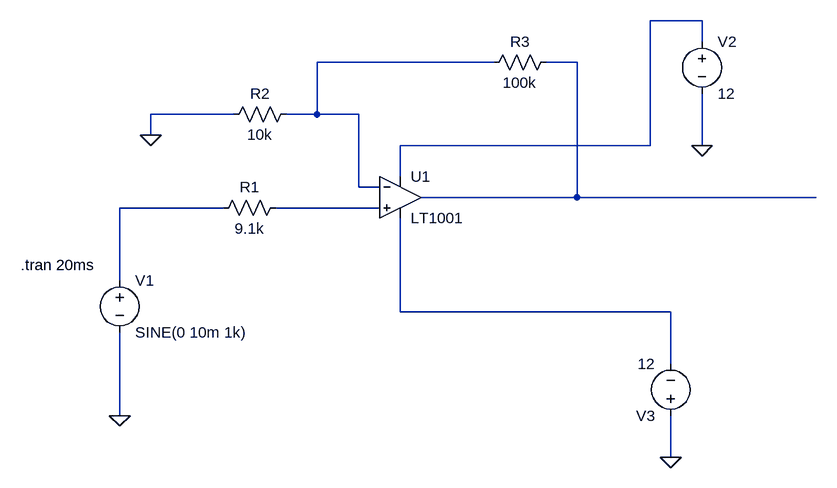
[diagram p0: schematic non-inverting amplifier.asc]
non-inverting amplifier.asc, the LTspice schematic file:
Version 4
SHEET 1 880 680
WIRE 688 -112 608 -112
WIRE 688 -80 688 -112
WIRE 368 -48 96 -48
WIRE 496 -48 448 -48
WIRE -32 32 -160 32
WIRE 96 32 96 -48
WIRE 96 32 48 32
WIRE 160 32 96 32
WIRE -160 64 -160 32
WIRE 608 80 608 -112
WIRE 608 80 224 80
WIRE 688 80 688 0
WIRE 224 128 224 80
WIRE 160 144 160 32
WIRE 192 144 160 144
WIRE 496 160 496 -48
WIRE 496 160 256 160
WIRE 864 160 496 160
WIRE -48 176 -208 176
WIRE 192 176 32 176
WIRE -208 288 -208 176
WIRE 224 336 224 192
WIRE 640 336 224 336
WIRE 640 416 640 336
WIRE -208 496 -208 368
WIRE 640 560 640 496
FLAG -208 496 0
FLAG -160 64 0
FLAG 688 80 0
FLAG 640 560 0
SYMBOL Opamps\\LT1001 224 96 R0
SYMATTR InstName U1
SYMBOL voltage -208 272 R0
WINDOW 123 0 0 Left 0
WINDOW 39 0 0 Left 0
SYMATTR InstName V1
SYMATTR Value SINE(0 10m 1k)
SYMBOL voltage 688 -96 R0
WINDOW 123 0 0 Left 0
WINDOW 39 0 0 Left 0
SYMATTR InstName V2
SYMATTR Value 12
SYMBOL voltage 640 512 R180
WINDOW 123 0 0 Left 0
WINDOW 39 0 0 Left 0
SYMATTR InstName V3
SYMATTR Value 12
SYMBOL res 48 160 R90
WINDOW 0 0 56 VBottom 2
WINDOW 3 32 56 VTop 2
SYMATTR InstName R1
SYMATTR Value 9.1k
SYMBOL res 64 16 R90
WINDOW 0 0 56 VBottom 2
WINDOW 3 32 56 VTop 2
SYMATTR InstName R2
SYMATTR Value 10k
SYMBOL res 464 -64 R90
WINDOW 0 0 56 VBottom 2
WINDOW 3 32 56 VTop 2
SYMATTR InstName R3
SYMATTR Value 100k
TEXT -360 264 Left 2 !.tran 20ms

The netlist it stands for:
* non-inverting amplifier.asc
XU1 N005 N002 N001 N006 N003 LT1001  ; pins In+ In- V+ V- OUT
V1 N004 0 SINE(0 10m 1k)
V2 N001 0 12
V3 0 N006 12
R1 N005 N004 9.1k
R2 N002 0 10k
R3 N003 N002 100k
.tran 20ms
.lib LTC.lib
.backanno
.end